# EAGLE design autoimpedance (EAGLE 6.5.0)

## Sheet 1 of 2: Power/charge
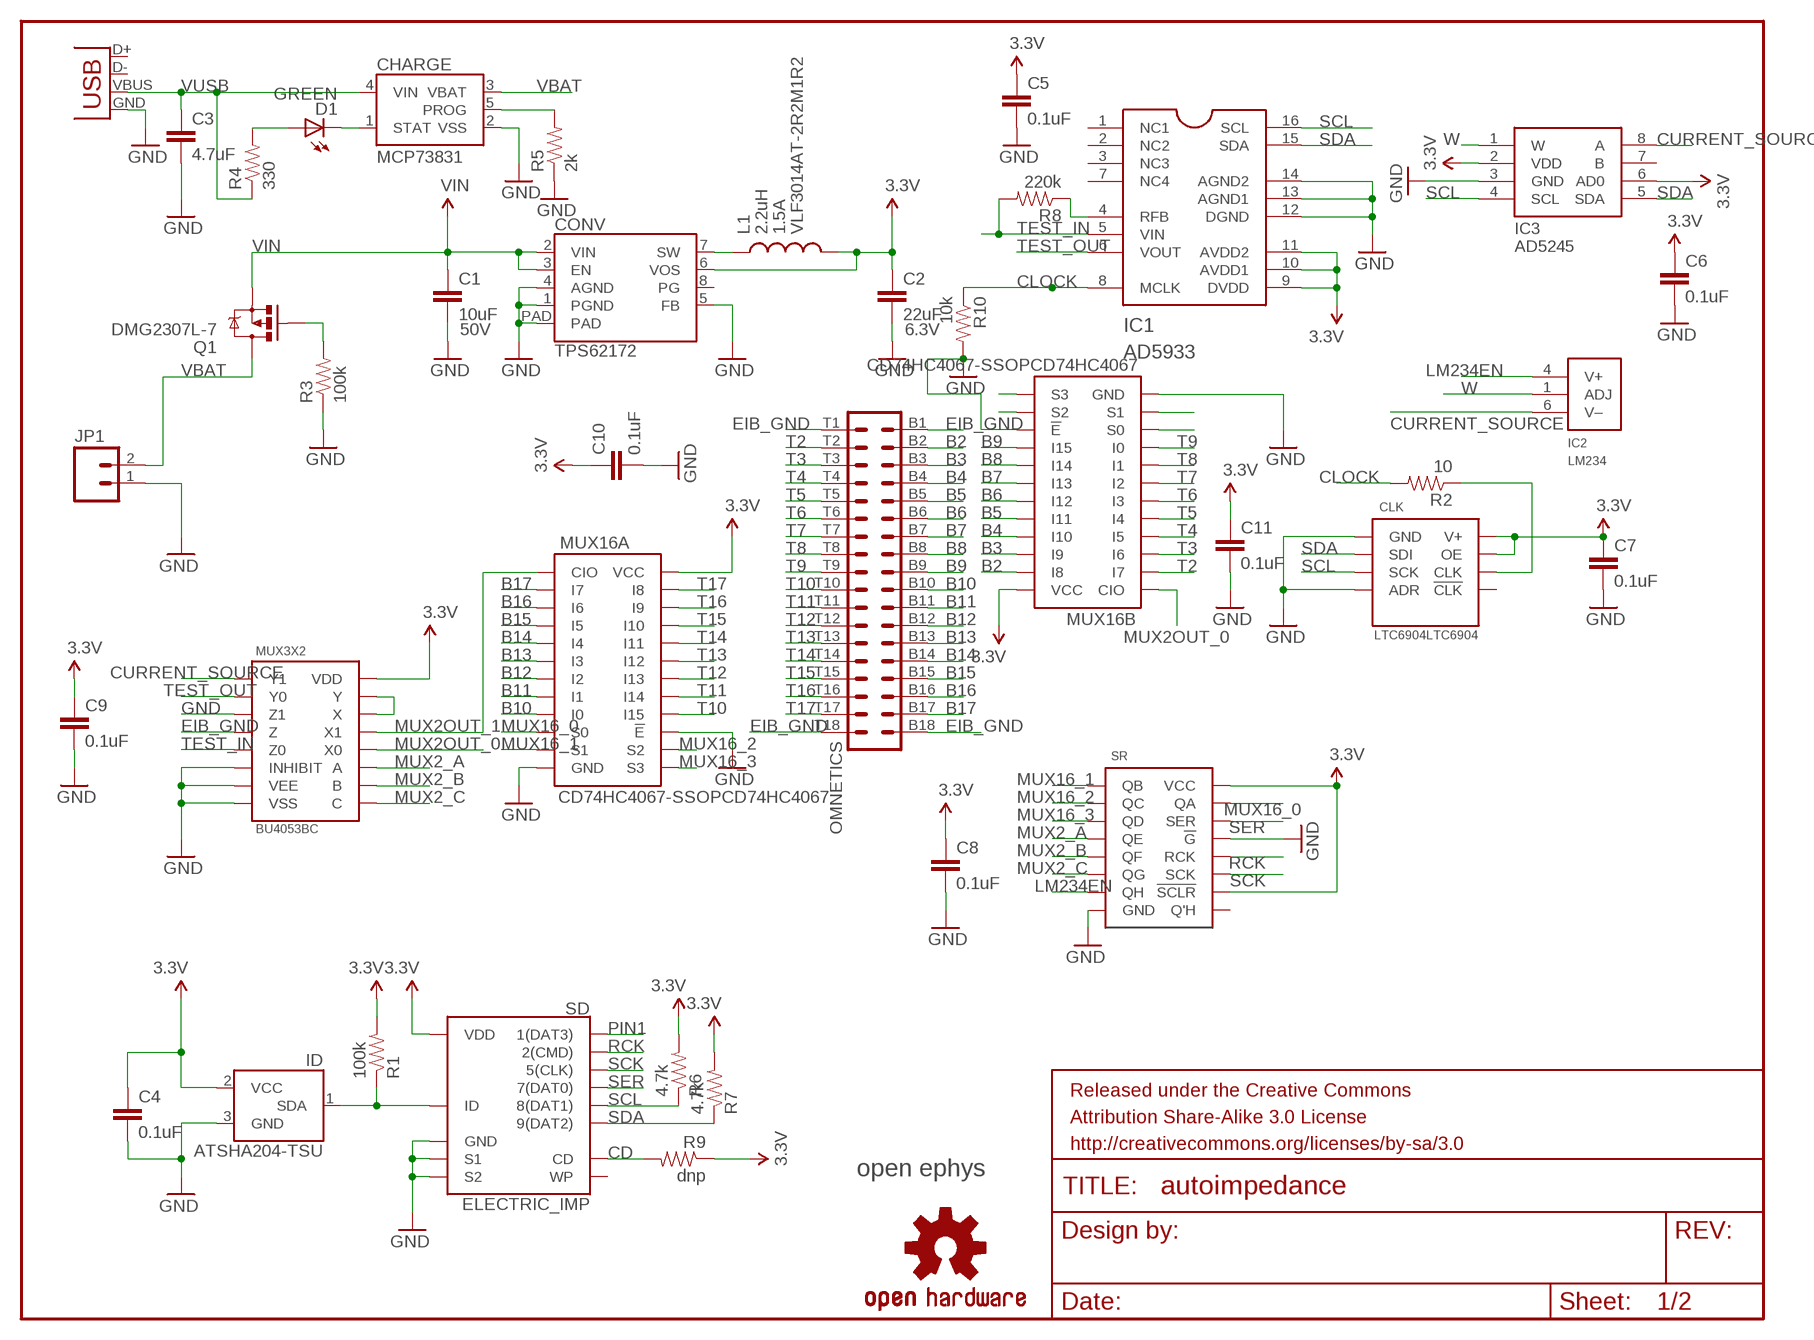
[diagram p0: schematic, sheet 1]

### Parts
C1  10uF  CAP1210  [1210]
C2  22uF  CAP0805  [0805]
C3  4.7uF  CAP1210  [1210]
C4  0.1uF  CAP0603-CAP  [0603-CAP]
C5  0.1uF  CAP0603-CAP  [0603-CAP]
C6  0.1uF  CAP0603-CAP  [0603-CAP]
C7  0.1uF  CAP0603-CAP  [0603-CAP]
C8  0.1uF  CAP0603-CAP  [0603-CAP]
C9  0.1uF  CAP0603-CAP  [0603-CAP]
C10  0.1uF  CAP0603-CAP  [0603-CAP]
C11  0.1uF  CAP0603-CAP  [0603-CAP]
CHARGE  MCP73831  [SOT23-5]
CLK  LTC6904LTC6904  [MSOP08]
CONV  TPS62172  [WSON-8-PAD]
D1  GREEN  LED-GREEN0603  [LED-0603]
FRAME1  FRAME-LETTER  [CREATIVE_COMMONS]
IC1  AD5933  [AD5933]
IC2  LM234  [LM234]
IC3  AD5245  [AD5245]
ID  ATSHA204-TSU  [SOT23-3]
JP1  M02SMD  [1X02_SMD]
L1  2.2uH  INDUCTORVLF4012A  [VLF4012A]
MUX3X2  BU4053BC  [SSOP16]
MUX16A  CD74HC4067-SSOPCD74HC4067  [SSOP24]
MUX16B  CD74HC4067-SSOPCD74HC4067  [SSOP24]
OMNETICS  OMNETICS_A79025  [OMNETICS_A79025]
Q1  DMG2307L-7  MOSFET-PCHANNELSMD  [SOT23-3]
R1  100k  RESISTOR0402-RES  [0402-RES]
R2  10  RESISTOR0402-RES  [0402-RES]
R3  100k  RESISTOR0402-RES  [0402-RES]
R4  330  RESISTOR0402-RES  [0402-RES]
R5  2k  RESISTOR0402-RES  [0402-RES]
R6  4.7k  RESISTOR0402-RES  [0402-RES]
R7  4.7k  RESISTOR0402-RES  [0402-RES]
R8  220k  RESISTOR0402-RES  [0402-RES]
R9  dnp  RESISTOR0402-RES  [0402-RES]
R10  10k  RESISTOR0402-RES  [0402-RES]
SD  ELECTRIC_IMP  [SD_MMC_SOCKET]
SR  MM74HC595MM74HC595  [TSSOP16]
U$5  OSHW-LOGOS  [OSHW-LOGO-S]
U$7  OPEN_EPHYS_LOGO  [OPEN_EPHYS_LOGO]
USB  USBSMD  [USB-MINIB]

### Nets
3.3V: C2.1 C4.1 C5.1 C6.1 C7.1 C8.1 C9.1 C10.1 C11.1 CLK.7(OE) CLK.8(V+) CONV.6(VOS) IC1.9(DVDD) IC1.10(AVDD1) IC1.11(AVDD2) IC3.2(VDD) IC3.6(AD0) ID.2(VCC) L1.P$2 MUX3X2.16(VDD) MUX16A.24(VCC) MUX16B.24(VCC) R1.2 R6.2 R7.2 R9.1 SD.4(VDD) SR.10(!SCLR) SR.16(VCC)
B2: MUX16B.23(I8) OMNETICS.B2
B3: MUX16B.22(I9) OMNETICS.B3
B4: MUX16B.21(I10) OMNETICS.B4
B5: MUX16B.20(I11) OMNETICS.B5
B6: MUX16B.19(I12) OMNETICS.B6
B7: MUX16B.18(I13) OMNETICS.B7
B8: MUX16B.17(I14) OMNETICS.B8
B9: MUX16B.16(I15) OMNETICS.B9
B10: MUX16A.9(I0) OMNETICS.B10
B11: MUX16A.8(I1) OMNETICS.B11
B12: MUX16A.7(I2) OMNETICS.B12
B13: MUX16A.6(I3) OMNETICS.B13
B14: MUX16A.5(I4) OMNETICS.B14
B15: MUX16A.4(I5) OMNETICS.B15
B16: MUX16A.3(I6) OMNETICS.B16
B17: MUX16A.2(I7) OMNETICS.B17
CD: R9.2 SD.CD
CLOCK: IC1.8(MCLK) R2.2 R10.1
CURRENT_SOURCE: IC2.6(V–) IC3.8(A) MUX3X2.1(Y1)
EIB_GND: MUX3X2.4(Z) OMNETICS.B1 OMNETICS.B18 OMNETICS.T1 OMNETICS.T18
GND: C1.2 C2.2 C3.2 C4.2 C5.2 C6.2 C7.2 C8.2 C9.2 C10.2 C11.2 CHARGE.2(VSS) CLK.1(GND) CLK.4(ADR) CONV.1(PGND) CONV.4(AGND) CONV.5(FB) CONV.PAD IC1.12(DGND) IC1.13(AGND1) IC1.14(AGND2) IC3.3(GND) ID.3(GND) JP1.1 MUX3X2.3(Z1) MUX3X2.6(INHIBIT) MUX3X2.7(VEE) MUX3X2.8(VSS) MUX16A.12(GND) MUX16A.15(!E) MUX16B.12(GND) MUX16B.15(!E) R3.1 R5.1 R10.2 SD.3(GND) SD.S1 SD.S2 SR.8(GND) SR.13(!G) USB.GND
ID: ID.1(SDA) R1.1 SD.6(ID)
LM234EN: IC2.4(V+) SR.7(QH)
MUX2_A: MUX3X2.11(A) SR.4(QE)
MUX2_B: MUX3X2.10(B) SR.5(QF)
MUX2_C: MUX3X2.9(C) SR.6(QG)
MUX2OUT_0: MUX3X2.12(X0) MUX16B.1(CIO)
MUX2OUT_1: MUX3X2.13(X1) MUX16A.1(CIO)
MUX16_0: MUX16A.10(S0) MUX16B.10(S0) SR.15(QA)
MUX16_1: MUX16A.11(S1) MUX16B.11(S1) SR.1(QB)
MUX16_2: MUX16A.14(S2) MUX16B.14(S2) SR.2(QC)
MUX16_3: MUX16A.13(S3) MUX16B.13(S3) SR.3(QD)
N$1: CONV.7(SW) L1.P$1
N$2: Q1.1(G) R3.2
N$3: IC1.4(RFB) R8.1
N$6: CHARGE.5(PROG) R5.2
N$8: D1.A R4.2
N$9: CHARGE.1(STAT) D1.C
N$25: CLK.6(CLK) R2.1
N$39: MUX3X2.14(X) MUX3X2.15(Y)
PIN1: SD.1(1(DAT3))
RCK: SD.2(2(CMD)) SR.12(RCK)
SCK: SD.5(5(CLK)) SR.11(SCK)
SCL: CLK.3(SCK) IC1.16(SCL) IC3.4(SCL) R6.1 SD.8(8(DAT1))
SDA: CLK.2(SDI) IC1.15(SDA) IC3.5(SDA) R7.1 SD.9(9(DAT2))
SER: SD.7(7(DAT0)) SR.14(SER)
T2: MUX16B.2(I7) OMNETICS.T2
T3: MUX16B.3(I6) OMNETICS.T3
T4: MUX16B.4(I5) OMNETICS.T4
T5: MUX16B.5(I4) OMNETICS.T5
T6: MUX16B.6(I3) OMNETICS.T6
T7: MUX16B.7(I2) OMNETICS.T7
T8: MUX16B.8(I1) OMNETICS.T8
T9: MUX16B.9(I0) OMNETICS.T9
T10: MUX16A.16(I15) OMNETICS.T10
T11: MUX16A.17(I14) OMNETICS.T11
T12: MUX16A.18(I13) OMNETICS.T12
T13: MUX16A.19(I12) OMNETICS.T13
T14: MUX16A.20(I11) OMNETICS.T14
T15: MUX16A.21(I10) OMNETICS.T15
T16: MUX16A.22(I9) OMNETICS.T16
T17: MUX16A.23(I8) OMNETICS.T17
TEST_IN: IC1.5(VIN) MUX3X2.5(Z0) R8.2
TEST_OUT: IC1.6(VOUT) MUX3X2.2(Y0)
VBAT: CHARGE.3(VBAT) JP1.2 Q1.3(D)
VIN: C1.1 CONV.2(VIN) CONV.3(EN) Q1.2(S)
VUSB: C3.1 CHARGE.4(VIN) R4.1 USB.VBUS
W: IC2.1(ADJ) IC3.1(W)
Unconnected: CLK.5(!CLK) CONV.8(PG) IC1.1(NC1) IC1.2(NC2) IC1.3(NC3) IC1.7(NC4) IC3.7(B) SD.WP SR.9(Q'H) USB.D+ USB.D-

### Notes on the sheet
- 1.5A | VLF3014AT-2R2M1R2
- 50V | 6.3V

## Sheet 2 of 2

## Library data of the parts
C1-C3 = SparkFun-Passives:CAP: Capacitor Standard 0603 ceramic capacitor, and 0.1" leaded capacitor.
C4-C11 = SparkFun-Capacitors:CAP: Capacitor Standard 0603 ceramic capacitor, and 0.1" leaded capacitor.
CHARGE = SparkFun-PowerIC:MCP73831: Miniature single cell, fully integrated Li-Ion, Li-polymer charge management controller http://ww1.microchip.com/downloads/en/DeviceDoc/21984a.pdf IC-09995; PROD_ID: IC-09995
CLK = open-ephys:LTC6904: I2C Clock LTC6904
CONV = SparkFun-PowerIC:TPS62172
D1 = SparkFun-LED:LED-GREEN: Various green LEDs 0603- DIO-00821 LARGE- DIO-00862 LILYPAD- DIO-09910; PROD_ID: DIO-00821
FRAME1 = SparkFun-Aesthetics:FRAME-LETTER: Schematic Frame Standard 8.5x11 US Letter frame
IC1 = autoimpedance:AD5933: I2C impedance tester
IC2 = josh:LM234
IC3 = autoimpedance:AD5245: I2C potentiometer (100KOhm)
ID = SparkFun-DigitalIC:ATSHA204
JP1 = SparkFun-Connectors:M02: Header 2 Standard 2-pin 0.1" header. Use with straight break away headers (SKU : PRT-00116), right angle break away headers (PRT-00553), swiss pins (PRT-00743), machine pins (PRT-00117), and female headers (PRT-00115). Molex polarized connector foot print use with SKU : PRT-08233 with associated crimp pins and housings.
L1 = SparkFun-Passives:INDUCTOR: Inductors Basic Inductor/Choke - 0603 and 1206. Footprints are not proven and vary greatly between part numbers. SRN6045- 33uH, 20% 1.4A
MUX3X2 = open-ephys:BU4053BC
MUX16A MUX16B = open-ephys:CD74HC4067-SSOP: High-speed CMOS Logic 16:1 Analog MUX
OMNETICS = RHD2000:OMNETICS_A79025
Q1 = SparkFun-DiscreteSemi:MOSFET-PCHANNEL: Generic PMOSFET
R1-R10 = SparkFun-Passives:RESISTOR: Resistor Basic schematic elements and footprints for 0603, 1206, and PTH resistors.
SD = SparkFun-RF:ELECTRIC_IMP
SR = open-ephys:MM74HC595: The MM74HC595 high-speed shift register possesses the high noise immunity and low power consumption of standard CMOS ICs, as well as the ability to drive 15 LS-TTL loads.
U$5 = SparkFun-Aesthetics:OSHW-LOGO: Open Source Hardware Logo This logo indicates the piece of hardware it is found on incorporates a OSHW license and/or adheres to the definition of open source hardware found here: http://freedomdefined.org/OSHW
U$7 = open-ephys:OPEN_EPHYS_LOGO: Open Ephys logo
USB = SparkFun-Connectors:USB: USB Connectors USB-B-PTH is fully proven SKU : PRT-00139 USB-miniB is fully proven SKU : PRT-00587 USB-A-PCB is untested. USB-A-H is throughly reviewed, but untested. Spark Fun Electronics SKU : PRT-00437 USB-B-SMT is throughly reviewed, but untested. Needs silkscreen touching up. USB-A-S has not been used/tested USB-MB-H has not been used/tested

## Board
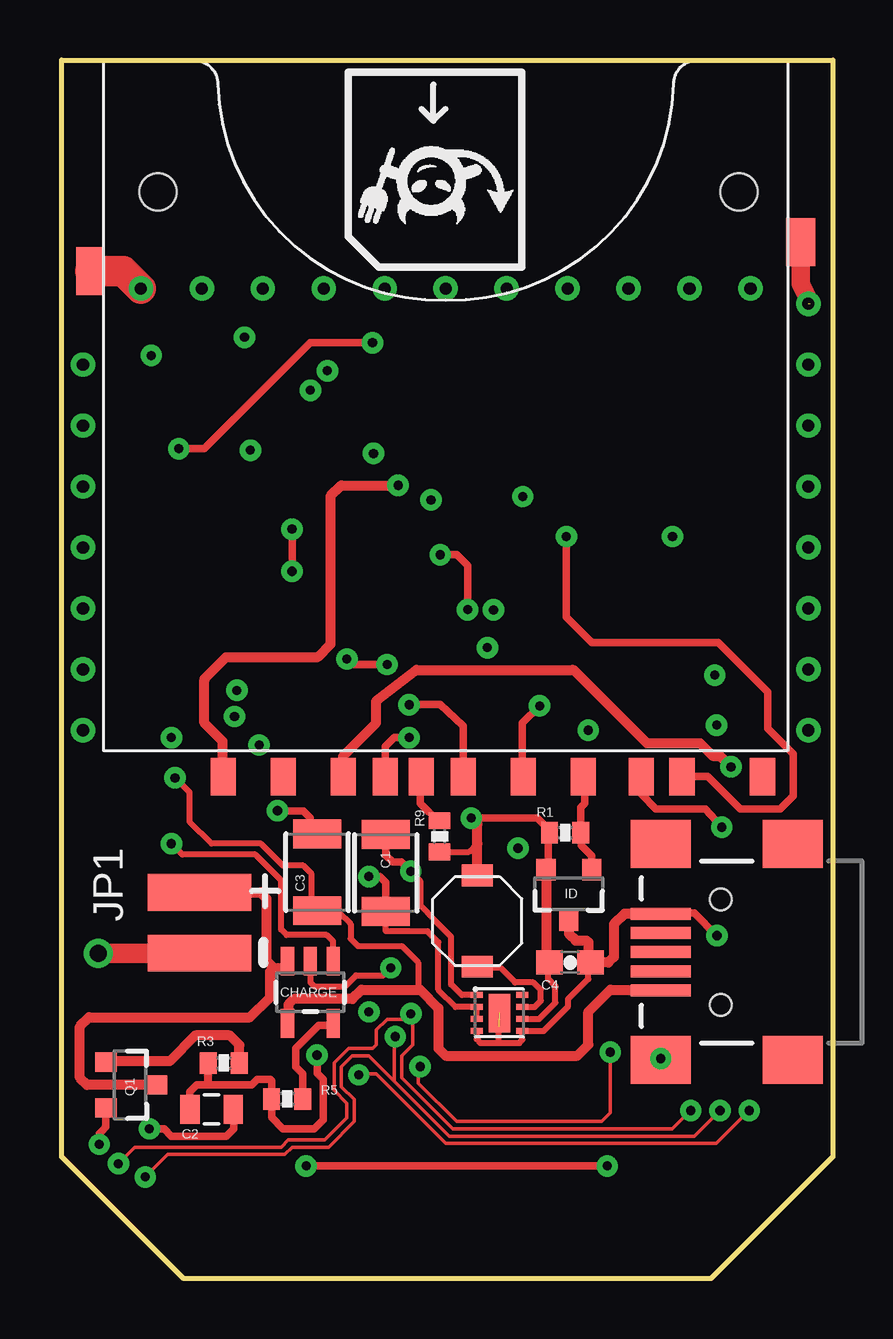
[diagram p1: board, top side]
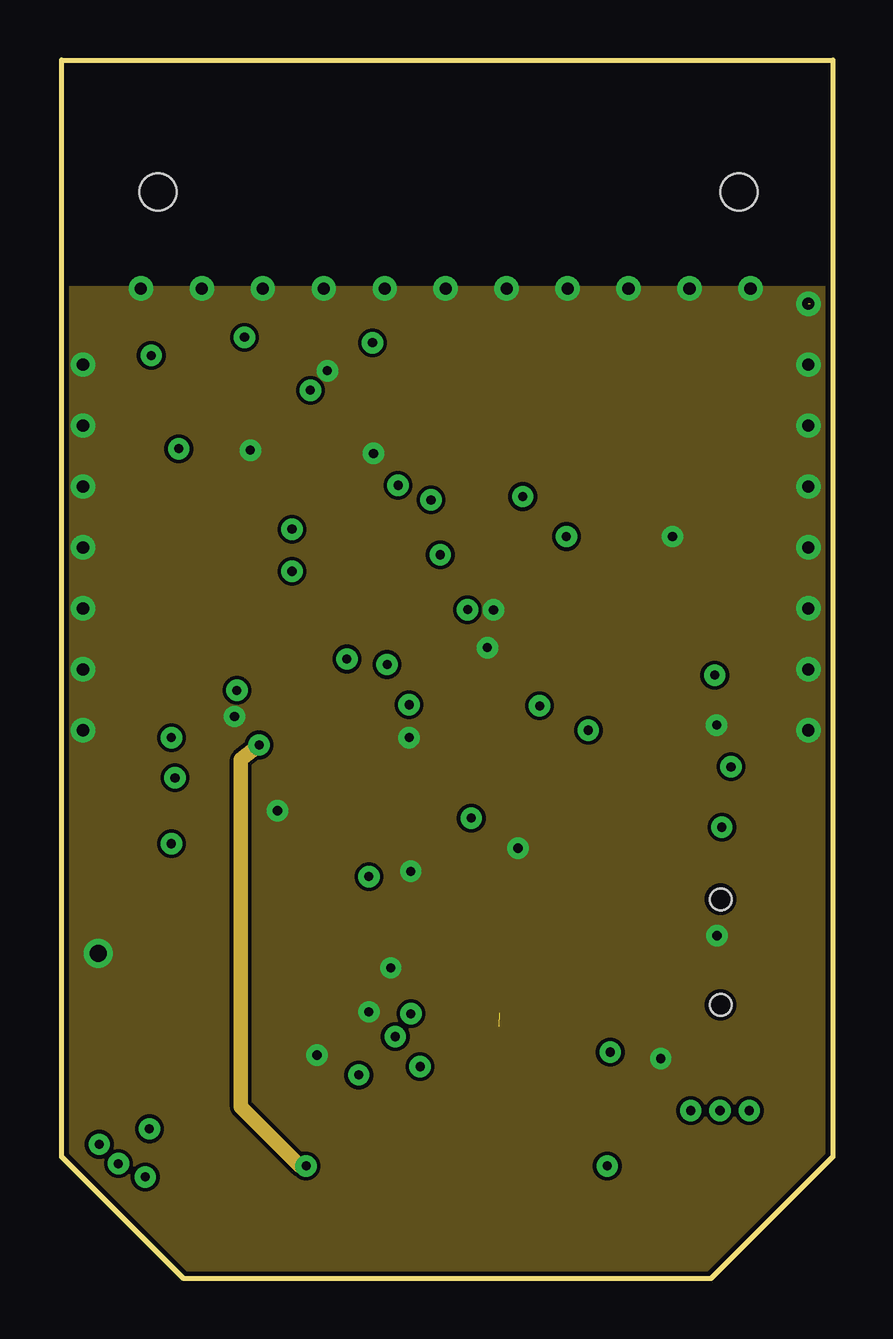
[diagram p2: board, inner layer Route2]
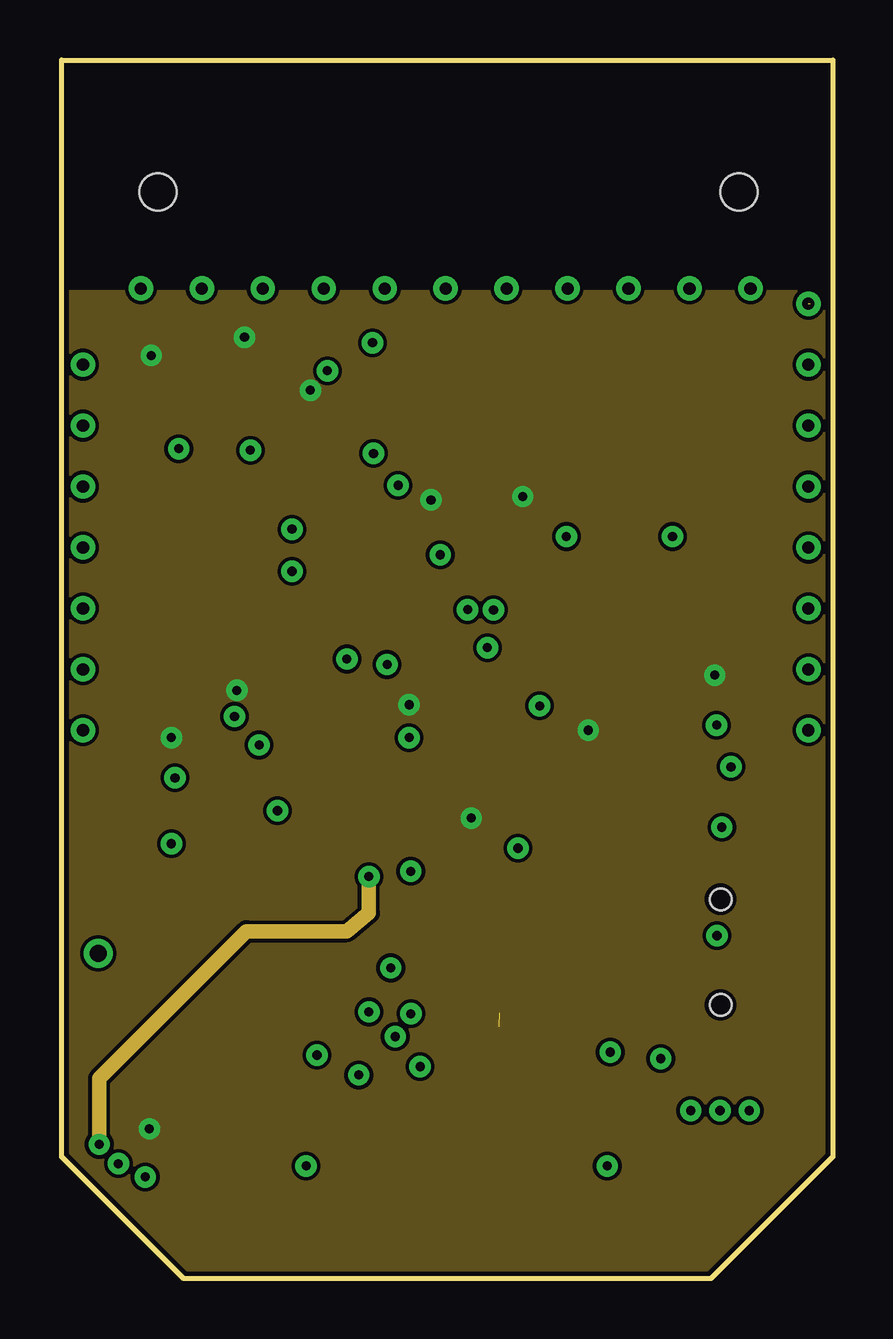
[diagram p3: board, inner layer Route3]
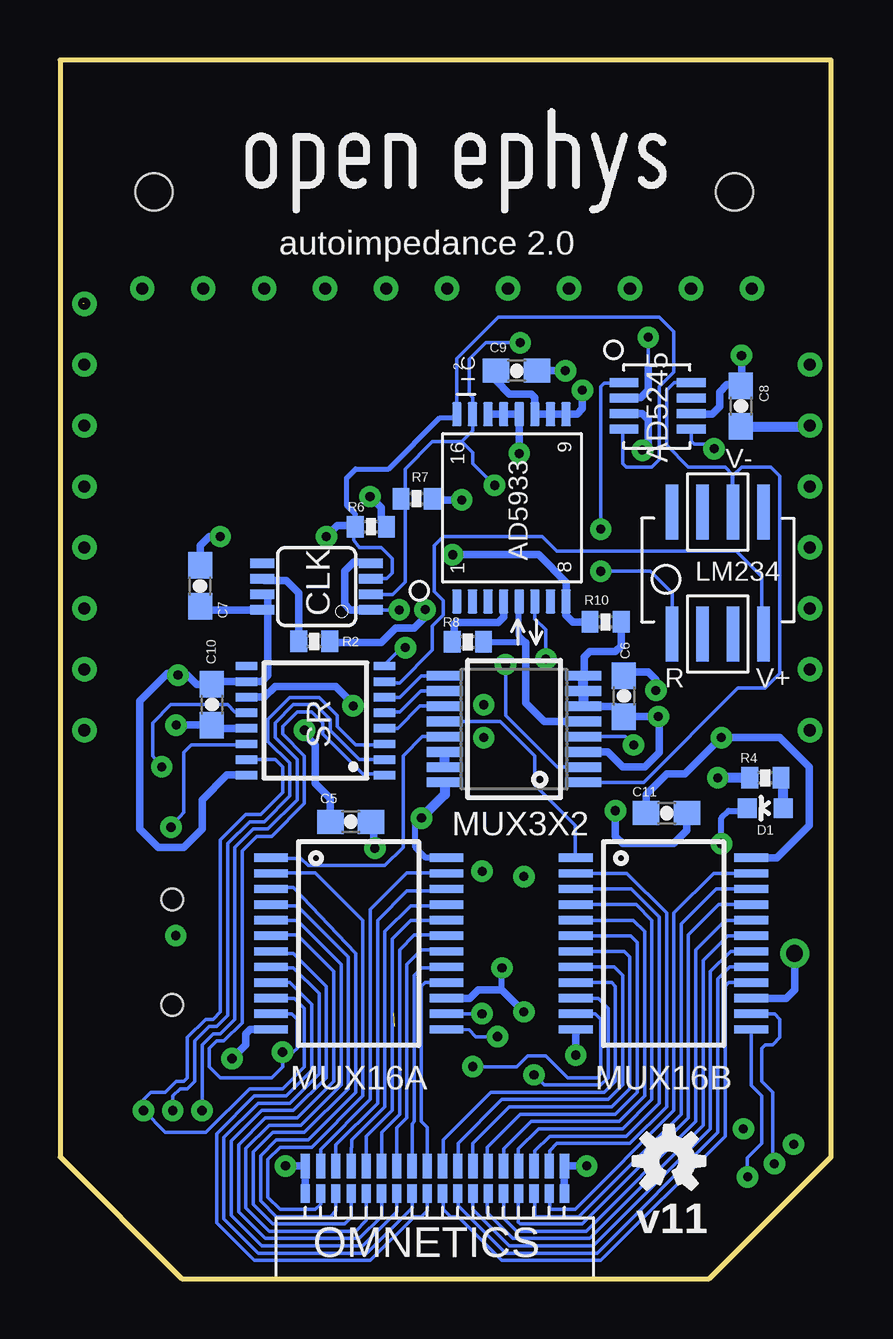
[diagram p4: board, bottom side, seen from below]

Size 32.13 x 50.8 mm. Coordinates in mm from the lower left corner, seen from the top.
Outline: 27.05,0 5.08,0 0,5.08 0,50.8 32.13,50.8 32.13,5.08 27.05,0
Copper layers (1*2*3*16): Top 0.035mm / dielectric 1.5mm / Route2 0.035mm / dielectric 0.15mm / Route3 0.035mm / dielectric 0.2mm / Bottom 0.035mm
Design rules "default *": minimum track width 6mil, minimum drill 15mil, track to track 6mil, track to pad 6mil, pad to pad 6mil, via to via 6mil, smd to smd 6mil, copper to edge 8mil, drill to drill 8mil, minimum pad ring 12mil, minimum via ring 10mil, stop-mask expansion 4mil, vias tented up to drill 20mil, thermal gap 10mil

### Footprints (pad centres in the part's own frame; a part is rotated, then mirrored left to right if it is on the bottom)
1210 = smd 1.2 x 2: 1 -1.6,0; 2 1.6,0
0805 = smd 0.8 x 1.2: 1 -0.9,0; 2 0.9,0
0603-CAP = smd 1.1 x 1: 1 -0.85,0; 2 0.85,0
SOT23-5 = smd 0.55 x 1.2: 1 -0.95,-1.3; 2 0,-1.3; 3 0.95,-1.3; 4 0.95,1.3; 5 -0.95,1.3
MSOP08 = smd 0.4 x 1: 1 -0.976,-2.263; 2 -0.326,-2.263; 3 0.324,-2.263; 4 0.974,-2.263; 5 0.974,2.262; 6 0.324,2.262; 7 -0.326,2.262; 8 -0.976,2.262
WSON-8-PAD = smd 0.25 x 0.5: 1 -0.75,-0.95; 2 -0.25,-0.95; 3 0.25,-0.95; 4 0.75,-0.95; 5 0.75,0.95; 6 0.25,0.95; 7 -0.25,0.95; 8 -0.75,0.95 | smd 1.6 x 0.9: PAD 0,0
LED-0603 = smd 0.8 x 0.8: A 0,-0.75; C 0,0.75
AD5933 = smd 1 x 0.4: 1 -4.128,2.54; 2 -4.128,1.89; 3 -4.128,1.24; 4 -4.128,0.59; 5 -4.128,-0.06; 6 -4.128,-0.71; 7 -4.128,-1.36; 8 -4.128,-2.01; 9 3.672,-2.01; 10 3.672,-1.36; 11 3.672,-0.71; 12 3.672,-0.06; 13 3.672,0.59; 14 3.672,1.24; 15 3.672,1.89; 16 3.672,2.54
LM234 = smd 0.508 x 2.286: 1 -1.905,-2.54; 2 -0.635,-2.54; 3 0.635,-2.54; 4 1.905,-2.54; 5 1.905,2.54; 6 0.635,2.54; 7 -0.635,2.54; 8 -1.905,2.54
AD5245 = smd 1.2 x 0.38: 1 -1.37,0.935; 2 -1.37,0.285; 3 -1.37,-0.365; 4 -1.37,-1.015; 5 1.43,-1.015; 6 1.43,-0.365; 7 1.43,0.285; 8 1.43,0.935
SOT23-3 = smd 0.8 x 0.9: 1 -0.95,-1; 2 0.95,-1; 3 0,1.1
1X02_SMD = smd 4.318 x 1.524: 1 0,1.27; 2 0,-1.27
VLF4012A = smd 0.9 x 1.3: P$1 -1.9,0; P$2 1.9,0
SSOP16 = smd 0.4 x 1.5: 1 -2.223,-2.883; 2 -1.587,-2.883; 3 -0.953,-2.883; 4 -0.318,-2.883; 5 0.318,-2.883; 6 0.953,-2.883; 7 1.587,-2.883; 8 2.223,-2.883; 9 2.223,2.883; 10 1.587,2.883; 11 0.953,2.883; 12 0.318,2.883; 13 -0.318,2.883; 14 -0.953,2.883; 15 -1.587,2.883; 16 -2.223,2.883
SSOP24 = smd 0.348 x 1.397: 1 -3.575,-3.656; 2 -2.925,-3.656; 3 -2.275,-3.656; 4 -1.625,-3.656; 5 -0.975,-3.656; 6 -0.325,-3.656; 7 0.325,-3.656; 8 0.975,-3.656; 9 1.625,-3.656; 10 2.275,-3.656; 11 2.925,-3.656; 12 3.575,-3.656; 13 3.575,3.656; 14 2.925,3.656; 15 2.275,3.656; 16 1.625,3.656; 17 0.975,3.656; 18 0.325,3.656; 19 -0.325,3.656; 20 -0.975,3.656; 21 -1.625,3.656; 22 -2.275,3.656; 23 -2.925,3.656; 24 -3.575,3.656
OMNETICS_A79025 = smd 0.381 x 0.762: B1 -5.397,-1.016; B2 -4.763,-1.016; B3 -4.128,-1.016; B4 -3.493,-1.016; B5 -2.857,-1.016; B6 -2.223,-1.016; B7 -1.587,-1.016; B8 -0.953,-1.016; B9 -0.318,-1.016; B10 0.318,-1.016; B11 0.953,-1.016; B12 1.587,-1.016; B13 2.223,-1.016; B14 2.857,-1.016; B15 3.493,-1.016; B16 4.128,-1.016; B17 4.763,-1.016; B18 5.397,-1.016 | smd 0.381 x 1.016: T1 -5.397,-2.159; T2 -4.763,-2.159; T3 -4.128,-2.159; T4 -3.493,-2.159; T5 -2.857,-2.159; T6 -2.223,-2.159; T7 -1.587,-2.159; T8 -0.953,-2.159; T9 -0.318,-2.159; T10 0.318,-2.159; T11 0.953,-2.159; T12 1.587,-2.159; T13 2.223,-2.159; T14 2.857,-2.159; T15 3.493,-2.159; T16 4.128,-2.159; T17 4.763,-2.159; T18 5.397,-2.159
0402-RES = smd 0.7 x 0.9: 1 -0.65,0; 2 0.65,0
SD_MMC_SOCKET = smd 1.05 x 1.56: 1 6.77,29.87; 2 4.27,29.87; 3 2.52,29.87; 4 -0.73,29.87; 5 -3.23,29.87; 6 -5.73,29.87; 7 -8.15,29.87; 8 -9.85,29.87; 9 9.27,29.87; CD 1.02,29.87; WP -13.2,29.87 | smd 1.2 x 2: S1 -14.8,7.6; S2 14.8,8.8 | hole 1.55: 11.98,5.5; -12.22,5.5
TSSOP16 = smd 0.9 x 0.35: 1 -2.875,2.275; 2 -2.875,1.625; 3 -2.875,0.975; 4 -2.875,0.325; 5 -2.875,-0.325; 6 -2.875,-0.975; 7 -2.875,-1.625; 8 -2.875,-2.275; 9 2.875,-2.275; 10 2.875,-1.625; 11 2.875,-0.975; 12 2.875,-0.325; 13 2.875,0.325; 14 2.875,0.975; 15 2.875,1.625; 16 2.875,2.275
USB-MINIB = smd 2.5 x 0.5: D+ 2.5,0; D- 2.5,0.8; GND 2.5,-1.6; ID 2.5,-0.8; VBUS 2.5,1.6 | smd 2.5 x 2: MTN1 -3,4.5; MTN2 2.5,4.5; MTN3 -3,-4.5; MTN4 2.5,-4.5 | hole 0.9: 0,2.2; 0,-2.2

### Placement (x,y rotation side)
C1  13.51,16.92 90 top
C2  6.25,7.06 180 top
C3  10.64,16.94 90 top
C4  21.18,13.18 0 top
C5  20.02,19.05 0 bottom
C6  8.64,24.28 270 bottom
C7  26.29,28.88 90 bottom
C8  3.76,36.37 270 bottom
C9  13.11,37.85 0 bottom
C10  25.81,23.93 270 bottom
C11  6.86,19.41 0 bottom
CHARGE  10.36,11.94 180 top
CLK  21.44,28.85 90 bottom
CONV  18.24,11.07 270 top
D1  2.74,19.61 90 bottom
FRAME1  -3.73,-11.73 0 top  (outside the outline)
IC1  13.06,32.36 90 bottom
IC2  4.72,29.41 0 bottom
IC3  7.26,36.42 0 bottom
ID  21.13,16.05 180 top
JP1  5.74,14.83 180 top
L1  17.32,14.91 90 top
MUX3X2  13.21,22.91 90 bottom
MUX16A  19.68,13.97 270 bottom
MUX16B  6.99,13.97 270 bottom
OMNETICS  16.51,2.54 180 bottom
Q1  2.84,8.08 270 top
R1  20.98,18.59 180 top
R2  21.54,26.57 0 bottom
R3  6.76,8.99 0 top
R4  2.74,20.88 0 bottom
R5  9.4,7.49 0 top
R6  19.18,31.34 0 bottom
R7  17.27,32.51 0 bottom
R8  15.14,26.54 0 bottom
R9  15.75,18.44 90 top
R10  9.4,27.38 0 bottom
SD  16,50.8 180 top
SR  21.49,23.27 180 bottom
U$5  6.76,4.9 0 bottom
U$7  25.04,43.94 0 bottom
USB  27.46,13.61 180 top

### Tracks (layer width: path | path; a pad name or v marks a point on that pad's centre or on a via)
3.3V  (via drill 0.38)
  Top 0.152: 20.27,18.23 R1.2 | 7.16,6.97 C2.1
  Top 0.254: CONV.6 19.89,10.82 20.57,11.51 20.57,12.19 20.27,12.5 20.27,13.19 C4.1 | R9.1 16.98,17.79 17.32,18.14
  Top 0.305: ID.2 20.26,17.06 20.27,17.6 20.27,18.23 | SD.4 16.73,23.04 15.77,23.93 v14.48,23.93 | v3.66,6.25 4.27,6.25 4.57,5.94 6.86,5.94 7.16,6.25 7.16,6.97 | C2.1 7.14,6.99 7.09,7.01 | R1.2 20.33,18.68 19.81,19.2 v17.07,19.2
  Top 0.406: ID.2 20.18,13.41 C4.1 | L1.P$2 17.32,18.14 17.32,18.95 v17.07,19.2 | 16.76,20.9 SD.4
  Bottom 0.152: 25.69,24.89 C10.1 | 5.74,35.97 IC3.6 | IC3.2 8.1,36.71 | 8.84,36.73 8.53,36.73 | 7.62,38.02 v7.62,39.24 | IC3.6 5.88,36.06 6.02,36.04 5.79,36.12 | 23.47,27.95 CLK.8 | C9.1 13.96,37.43 | IC1.11 | R6.2 18.75,31.55 | R7.2 16.51,32.51 16.46,32.46 | 27.23,25.22 v27.21,25.16 | C8.1 3.77,37.53 3.77,37.38 | 5.77,36.12 IC3.6 | 26.21,27.88 C7.1
  Bottom 0.254: MUX16A.24 16.89,17.55 17.32,17.98 17.32,18.95 v17.07,19.2 | 8.47,25.3 C6.1 8.84,24.93
  Bottom 0.305: SR.16 25.19,20.99 26.21,19.96 26.21,18.75 26.98,17.98 28.04,17.98 28.8,18.75 28.8,24.08 27.66,25.22 27.23,25.22 | 25.69,24.89 SR.10 23.72,24.89 23.47,25.15 23.47,27.95 23.47,28.56 CLK.7 | 8.1,36.71 8.84,36.73 | 8.53,36.73 7.92,36.73 7.62,37.03 7.62,38.02 | C11.1 7.71,20.18 6.86,21.03 6.1,21.03 v4.57,22.55 2.13,22.55 0.91,21.34 0.91,18.9 2.27,17.55 MUX16B.24 | C10.1 26.44,24.77 26.83,25.16 v27.21,25.16 | IC1.11 IC1.10 IC1.9 10.58,36.03 10.36,36.27 v10.36,37.03 | 13.96,37.43 13.41,36.88 12.5,36.88 12.34,36.73 IC1.11 | 18.75,31.55 18.75,32.14 v19.21,32.6 | 16.46,32.46 v15.39,32.46 | CLK.8 26.21,27.88 | C5.1 20.86,20.03 21.49,20.65 21.49,22.25 21.95,22.71 v21.95,22.86 | v7.3,24.52 7.3,24.98 7.62,25.3 8.47,25.3 | 6.02,36.04 4.95,36.04 4.65,36.35 4.65,36.96 4.34,37.26 3.8,37.26 C8.1 | 3.77,37.53 3.73,37.57 v3.73,38.48
  Bottom 0.406: MUX3X2.16 16.09,20.18 v17.07,19.2
  pour Route3: 0.15,4.72 0.3,4.72 5.03,0 27.13,0 32,4.88 32.16,5.03 32.16,41.15 0.3,41.15 0.15,41
B2
  Bottom 0.152: MUX16B.23 4.9,16.89 6.55,15.24 6.55,7.01 10.67,2.9 11.73,2.9 11.73,3.54 OMNETICS.B2
B3
  Bottom 0.152: MUX16B.22 4.79,16.25 6.25,14.78 6.25,6.86 10.52,2.59 12.34,2.59 12.34,3.52 OMNETICS.B3
B4
  Bottom 0.152: MUX16B.21 4.67,15.6 5.94,14.33 5.94,6.71 10.36,2.29 12.95,2.29 13.03,2.36 13.03,3.39 OMNETICS.B4
B5
  Bottom 0.152: MUX16B.20 4.41,14.95 5.64,13.72 5.64,6.55 10.21,1.98 13.11,1.98 13.64,2.52 13.64,3.42 OMNETICS.B5
B6
  Bottom 0.152: MUX16B.19 4.3,14.29 5.33,13.26 5.33,6.4 10.06,1.68 13.26,1.68 14.33,2.74 14.33,3.52 OMNETICS.B6
B7
  Bottom 0.152: MUX16B.18 4.19,13.64 5.03,12.8 5.03,6.25 9.91,1.37 13.41,1.37 14.94,2.9 14.94,3.54 | 14.94,3.66 14.94,3.54 | 14.94,3.54 OMNETICS.B7
B8
  Bottom 0.152: MUX16B.17 4.23,12.99 4.72,12.5 4.72,6.1 9.75,1.07 13.56,1.07 15.54,3.05 15.54,3.54 OMNETICS.B8
B9
  Bottom 0.152: MUX16B.16 4.27,12.35 4.42,12.19 4.42,5.94 9.6,0.76 13.72,0.76 15.54,2.59 15.85,2.59 16.15,2.9 16.15,3.52 OMNETICS.B9
B10
  Bottom 0.152: OMNETICS.B10 16.83,2.83 17.07,2.59 17.37,2.59 19.2,0.76 24.03,0.76 25.6,2.34 25.6,6.04 24.03,7.62 22.71,7.62 21.64,8.69 21.64,11.43 22.55,12.34 MUX16A.9
B11
  Bottom 0.152: OMNETICS.B11 17.46,2.96 19.36,1.07 23.88,1.07 25.3,2.49 25.3,5.89 23.88,7.32 22.55,7.32 21.34,8.53 21.34,11.89 22.4,12.95 23.3,12.95 MUX16A.8
B12
  Bottom 0.152: OMNETICS.B12 18.1,2.78 19.51,1.37 23.72,1.37 24.99,2.64 24.99,5.74 23.72,7.01 22.4,7.01 21.03,8.38 21.03,12.19 22.4,13.56 23.26,13.56 MUX16A.7
B13
  Bottom 0.152: OMNETICS.B13 18.73,2.6 19.66,1.68 23.57,1.68 24.69,2.79 24.69,5.59 23.57,6.71 22.25,6.71 20.73,8.23 20.73,12.8 22.25,14.33 23.31,14.33 MUX16A.6
B14
  Bottom 0.152: OMNETICS.B14 19.37,2.43 19.81,1.98 23.42,1.98 24.38,2.95 24.38,5.44 23.42,6.4 22.1,6.4 20.42,8.08 20.42,13.11 22.25,14.94 23.33,14.94 MUX16A.5
B15
  Bottom 0.152: OMNETICS.B15 20,2.55 20.27,2.29 23.27,2.29 24.08,3.1 24.08,5.28 23.27,6.1 21.95,6.1 20.12,7.92 20.12,13.41 22.25,15.54 23.29,15.54 MUX16A.4
B16
  Bottom 0.152: OMNETICS.B16 20.64,2.83 20.88,2.59 23.11,2.59 23.77,3.25 23.77,5.13 23.11,5.79 21.79,5.79 19.81,7.77 19.81,13.56 22.4,16.31 23.28,16.31 MUX16A.3
B17
  Bottom 0.152: OMNETICS.B17 21.27,3.11 21.49,2.9 22.96,2.9 23.47,3.4 23.47,4.98 22.96,5.49 21.64,5.49 19.51,7.62 19.51,14.94 21.49,16.92 23.32,16.92 MUX16A.2
CD
  Top 0.152: 14.87,20.82 SD.CD
  Top 0.254: 14.94,20.88 SD.CD
  Top 0.305: R9.2 15.29,19.46 14.94,19.81 14.94,20.88
CLOCK  (via drill 0.38)
  Top 0.305: v15.77,30.18 16.46,30.18 16.92,29.72 v16.92,27.89
  Bottom 0.152: 20.84,26.52 R2.2
  Bottom 0.305: v15.77,30.18 12.19,30.18 11.05,29.03 IC1.8 11.05,27.66 10.77,27.38 R10.1 | v16.92,27.89 16.92,27.58 17.37,27.13 18.14,27.13 18.75,26.52 20.84,26.52
CURRENT_SOURCE
  Bottom 0.152: MUX3X2.1 7.81,20.69 3.89,24.61 2.74,24.61 2.13,25.22 2.13,33.45 2.52,33.83 3.73,33.83 4.09,33.48 IC2.6 4.04,32 4.04,32.54 4.12,32.61 4.12,33.53 4.42,33.83 5.94,33.83 6.86,34.75 6.86,37.03 6.53,37.36 IC3.8
EIB_GND  (via drill 0.38)
  Top 0.305: v10.19,4.7 v22.73,4.7
  Route2 0.152: v10.19,4.7 10.08,4.7
  Route2 0.61: 10.08,4.7 9.93,4.7 7.47,7.16 7.47,21.64 v8.23,22.25
  Bottom 0.152: MUX3X2.4 8.57,22.59 v8.23,22.25
  Bottom 0.305: OMNETICS.B1 OMNETICS.T1 v10.19,4.7 | OMNETICS.B18 OMNETICS.T18 v22.73,4.7
GND  (via drill 0.38, 0.51, 0.7)  (2 unrouted)
  Top 0.152: USB.GND 25.91,15.24
  Top 0.254: CONV.1 16.67,11.82 16.23,12.27 16.23,14.25 15.54,14.94 14.96,15.54 14.94,15.57 14.94,16.59 v14.54,16.98 | C4.2 21.95,13.17 21.95,12.5 21.11,11.66 21.11,11.35 20.08,10.32 CONV.5 19.2,10.31 19.2,9.96 19.07,9.83 18.21,9.83 18.21,9.91 | CHARGE.2 10.36,12.34 10.52,12.19 11.81,12.19 12.27,12.65 13.41,12.65 v13.72,12.95 | CONV.4 17.29,9.99 17.45,9.83 18.14,9.83 18.21,9.91 | 18.21,9.91 18.21,10.52
  Top 0.305: SD.3 13.48,22.18 13.87,22.55 v14.48,22.55 | 25.91,15.24 26.36,15.24 v27.3,14.3 | C2.2 5.35,7.79 5.64,8.08 6.1,8.08 | 6.1,8.08 6.1,8.83 R3.1 6.11,8.37 6.1,8.08 | 6.1,8.08 7.92,8.08 8.15,8.31 8.7,8.31 8.75,8.26 R5.1 8.75,6.72 9.22,6.25 10.52,6.25 10.9,6.63 10.9,8.31 10.64,8.56 v10.64,9.32 | C1.2 13.51,17.65 13.79,17.37 14.15,17.37 v14.54,16.98 | v8.99,19.51 10.06,19.51 10.36,19.2 10.36,18.52 C3.2
  Top 0.406: USB.GND 23.44,15.21 23.01,14.78 23.01,13.41 22.78,13.18 C4.2 21.95,13.35 21.95,14.02 21.87,14.1 21.41,14.1 21.13,14.38 ID.3
  Top 0.762: SD.S1 30.8,41.47 31.19,40.64
  Top 0.813: JP1.1 v1.52,13.56
  Top 1.27: SD.S2 2.58,42 v3.3,41.27
  Bottom 0.152: MUX16B.12 10.36,10.36 | SR.8 18.59,25.6 17.89,26.3 v17.74,26.3 | 25.67,22.94 C10.2 | v27.3,14.3 27.28,14.33 | CLK.1 v17.99,27.88 | v14.48,22.55 14.33,22.55 | C6.2 8.65,23.28 | 8.65,23.28 8.99,23.85 | 10.26,23.85 MUX3X2.6 | C5.2 19.05,19.2 | 19.05,17.98 v19.01,17.95 | 8.65,23.28 8.88,23.28 8.69,23.32 | 7.16,23.39 v7.2,23.43 | MUX3X2.8 10.32,25.18 | 8.99,27.14 R10.2 | 0.93,35.52 v0.89,35.56
  Bottom 0.254: 13.72,12.04 v13.72,12.95
  Bottom 0.305: MUX3X2.3 9.31,21.96 8.69,21.34 7.77,21.34 7.16,21.95 7.16,23.39 | SR.13 25.67,22.94 | C7.2 26.29,30.56 25.91,30.94 v25.45,30.94 | C9.2 v11.07,37.85 | 8.99,23.85 10.26,23.85 | C6.2 v7.2,23.43 | 19.05,19.2 19.05,17.98 | C10.2 v27.29,23.08 | MUX16B.15 1.87,11.7 1.52,12.04 v1.52,13.56 | C11.2 6.01,18.68 6.55,18.14 8.69,18.14 8.99,18.44 v8.99,19.51 | IC1.14 IC1.13 IC1.12 v13,34.4 | MUX16A.12 24.2,10.39 24.38,10.21 24.38,9.75 v24.96,9.18 | MUX16A.15 15.05,11.7 14.71,12.04 13.72,12.04 v12.8,11.12 | IC3.3 7.87,36.06 7.62,35.81 7.62,34.78 v7.87,34.53 | 10.32,25.18 10.29,25.22 10.29,25.91 10.06,26.14 8.99,26.14 8.75,26.38 R10.2 | CLK.1 20.03,27.88 20.27,28.12 20.27,29.49 19.89,29.87 19.22,29.87 CLK.4 | 10.36,10.36 10.51,10.36 10.64,10.24 v10.64,9.32
  Bottom 0.406: C8.2 0.93,35.52 | MUX3X2.8 MUX3X2.7 MUX3X2.6
  other vias: 31.11,40.64 31.11,38.1 31.11,35.56 31.11,33.02 31.11,30.48 31.11,27.94 31.11,25.4 31.11,22.86 0.89,22.86 0.89,25.4 0.89,27.94 0.89,30.48 0.89,33.02 0.89,38.1 5.84,41.27 8.38,41.27 10.92,41.27 13.46,41.27 16,41.27 18.54,41.27 21.08,41.27 23.62,41.27 26.16,41.27 28.7,41.27
  pour Route2: 0.3,5.18 5.33,0.15 5.33,0 26.67,0 32,5.33 32,41.3 0.15,41.3 0,41
ID
  Top 0.152: 21.64,18.28 R1.1 | 21.79,20.87 SD.6
  Top 0.305: ID.1 22.08,17.62 21.64,18.06 21.64,18.28 | R1.1 21.63,19.65 21.79,19.81 21.79,20.87
LM234EN
  Bottom 0.152: SR.7 18.56,24.84 17.98,24.84 16.61,26.21 16.61,27.2 16.15,27.66 16.15,28.27 16.54,28.65 16.54,30.56 16.15,30.94 12.04,30.94 11.43,30.33 3.96,30.33 2.9,29.26 2.9,26.95 IC2.4
MUX2_A
  Bottom 0.152: MUX3X2.11 17.13,23.86 18.06,22.94 18.53,22.94 SR.4
MUX2_B
  Bottom 0.152: MUX3X2.10 17.11,24.5 17.98,23.62 18.58,23.62 SR.5
MUX2_C
  Bottom 0.152: MUX3X2.9 17.08,25.13 17.98,24.23 SR.6
MUX2OUT_0
  Bottom 0.152: MUX3X2.12 13.78,23.23 12.34,21.79 12.34,20.57 10.67,18.9 10.67,17.57 MUX16B.1
MUX2OUT_1
  Bottom 0.152: MUX3X2.13 17.03,22.59 17.83,21.79 17.83,17.98 18.59,17.22 21.79,17.22 22.1,17.53 23.32,17.53 MUX16A.1
MUX16_0  (via drill 0.38)
  Top 0.152: v12.38,8.49 12.34,8.53 13.11,8.53 16,5.64 27.28,5.64 v28.65,7.01
  Bottom 0.152: SR.15 23.16,21.64 22.86,21.34 22.86,20.27 23.77,19.36 24.38,19.36 25.45,18.29 25.45,11.12 25.76,10.82 26.06,10.82 26.82,10.06 26.82,8.38 26.98,8.23 27.28,8.23 27.74,7.77 28.35,7.77 28.65,7.47 v28.65,7.01 27.74,6.1 26.06,6.1 24.23,7.92 22.86,7.92 21.95,8.84 21.95,11.28 22.36,11.7 MUX16A.10 | MUX16B.10 9.71,11.7 9.3,11.28 9.3,8.38 9.6,8.08 11.96,8.08 v12.38,8.49
MUX16_1  (via drill 0.38)
  Top 0.152: v22.86,9.45 22.86,6.91 22.5,6.55 16.46,6.55 14.86,8.15 14.86,8.61 v14.94,8.84
  Bottom 0.152: 23.41,10.97 MUX16A.11 22.48,11.04 22.25,10.82 22.25,9.6 22.4,9.45 v22.86,9.45 | 22.86,8.99 v22.86,9.45 | 11.05,11.04 MUX16B.11 9.83,11.04 9.6,10.82 9.6,8.53 9.75,8.38 10.97,8.38 11.89,9.3 12.65,9.3 13.11,8.84 v14.94,8.84 | v22.86,9.45 22.86,8.84 23.32,8.38 25.45,8.38 25.91,8.84 25.91,9.6 25.6,9.91 25.3,9.91 24.54,10.67 24.54,17.83 23.93,18.44 23.32,18.44 21.95,19.81 21.95,21.79 22.86,22.71 22.86,23.01 22.25,23.62 21.64,23.62 21.18,23.16 21.18,22.71 19.51,21.03 18.65,21.03 SR.1
MUX16_2  (via drill 0.38)
  Top 0.152: 26.06,7.06 v26.21,7.01 25.45,6.25 16.31,6.25 14.17,8.38 14.17,9.3 14.63,9.75 14.63,11.12 v14.55,11.04 14.33,10.82 13.56,10.82 13.11,10.36 13.11,9.75 12.95,9.6 11.96,9.6 11.35,8.99 11.35,7.85 11.89,7.32 11.89,6.71 10.97,5.79 9.45,5.79 9.14,5.49 3.06,5.49 v2.37,4.8
  Bottom 0.152: MUX16A.14 v14.55,11.04 | v26.21,7.01 26.21,9.75 25.76,10.21 25.45,10.21 24.84,10.82 24.84,17.98 24.08,18.75 23.47,18.75 22.25,19.96 22.25,21.64 23.16,22.55 23.16,23.16 22.4,23.93 21.49,23.93 20.88,23.32 20.88,22.86 19.66,21.64 SR.2 | MUX16B.14 2.36,11.04 2.13,10.82 2.13,10.06 2.44,9.75 2.74,9.75 2.9,9.6 2.9,8.23 2.44,7.77 2.44,4.87 v2.37,4.8
MUX16_3  (via drill 0.38)
  Top 0.152: 13.87,8.23 16.15,5.94 26.36,5.94 v27.43,7.01 | v13.9,10.09 13.87,9.6 13.87,8.23 | 13.87,8.23 12.8,9.3 12.12,9.3 11.66,8.84 11.66,8 12.19,7.47 12.19,6.55 11.12,5.49 9.6,5.49 9.3,5.18 4.42,5.18 v3.48,4.24
  Bottom 0.152: MUX16A.13 15.09,10.36 14.81,10.09 v13.9,10.09 | v27.43,7.01 27.43,7.62 27.13,7.92 26.82,7.92 26.52,8.23 26.52,9.91 25.91,10.52 25.6,10.52 25.15,10.97 25.15,18.14 24.23,19.05 23.62,19.05 22.55,20.12 22.55,21.49 23.47,22.4 23.47,23.32 22.55,24.23 21.34,24.23 20.57,23.47 20.57,23.01 19.81,22.25 18.65,22.25 SR.3 | MUX16B.13 3.33,8.05 2.9,7.62 2.9,5.64 3.5,5.03 3.5,4.27 v3.48,4.24
N$1
  Top 0.254: CONV.7 19.71,11.32 19.96,11.58 19.96,12.04 19.66,12.34 18.9,12.34 18.29,12.95 17.38,12.95 L1.P$1
N$2
  Top 0.305: 1.96,9.07 Q1.1
  Top 0.406: R3.2 7.41,9.74 7.01,10.13 5.56,10.13 4.5,9.07 1.96,9.07
N$3
  Bottom 0.152: IC1.4 13.64,28.16 | 15.7,26.86 R8.1
  Bottom 0.305: 13.64,28.16 13.64,27.58 13.87,27.36 15.62,27.36 15.7,27.28 15.7,26.86
N$6
  Top 0.305: CHARGE.5 11.35,10.59 11.32,10.56 10.71,10.56 9.75,9.6 9.75,8.84 10.05,8.54 R5.2
N$8
  Bottom 0.152: 1.99,20.78 R4.2
  Bottom 0.406: D1.A 1.99,20.78
N$9  (via drill 0.38)
  Top 0.254: CHARGE.1 11.31,14.06 11.05,14.33 9.37,14.33 9.14,14.55 9.14,16.61 8.08,17.68 5.03,17.68 v4.57,18.14
  Bottom 0.254: v4.57,18.14 4.57,19.2 4.27,19.51 3.6,19.51 D1.C
N$25
  Bottom 0.152: 23.63,29.11 CLK.6
  Bottom 0.305: R2.1 22.19,28.59 22.71,29.11 23.63,29.11
N$39
  Bottom 0.406: MUX3X2.15 MUX3X2.14
RCK  (via drill 0.38)
  Top 0.406: SD.2 11.73,21.74 arc-45 11.77,21.83 13.11,23.16 13.11,24.03 arc-45 13.14,24.12 14.78,25.38 21.28,25.38 arc-45 21.37,25.34 24.38,22.33 26.54,22.33 arc-45 26.63,22.29 27.13,21.79 27.43,21.79 v27.89,21.34 27.85,21.38
  Bottom 0.152: v27.89,21.34 28.27,21.79 28.27,23.16 27.51,23.93 25.15,23.93 24.84,23.62 24.39,23.62 SR.12
SCK  (via drill 0.38)
  Top 0.152: SD.5 19.2,20.88
  Top 0.305: 19.2,20.88 19.2,23.16 v19.92,23.88
  Bottom 0.305: SR.11 23.61,24.24 23.16,24.69 20.65,24.69 19.81,23.85 19.81,23.83 v19.92,23.88
SCL  (via drill 0.38)
  Top 0.305: SD.8 26.92,20.93 28.27,19.58 29.95,19.58 30.48,20.12 30.48,21.87 29.41,22.94 29.41,24.46 27.36,26.52 22.1,26.52 21.03,27.58 v21.03,30.94
  Bottom 0.152: CLK.3 18.52,29.18 18.29,29.41 18.29,30.02 18.75,30.48 19.66,30.48 19.89,30.79 19.89,31.28 R6.1 | IC1.16 15.6,38.35 13.87,40.08 7.16,40.08 6.55,39.47 6.55,37.8 7.16,37.19 7.16,34.14 7.47,33.83 8.53,33.83 8.69,33.98 8.69,35.36 IC3.4
  Bottom 0.203: R6.1 19.83,31.87 20.19,32.23 20.19,33.38 19.81,33.76 18.44,33.76 16.31,35.89 15.74,35.89 IC1.16
  Bottom 0.305: v21.03,30.94 20.57,31.39 19.88,31.39 R6.1
SDA  (via drill 0.38)
  Top 0.305: v4.88,34.59 5.94,34.59 10.36,39.01 v12.95,39.01
  Top 0.406: SD.9 6.71,20.93 6.71,22.4 5.94,23.16 5.94,24.94 arc-45 5.98,25.03 6.86,25.91 10.62,25.91 arc45 10.71,25.95 11.2,26.44 11.2,32.61 11.66,33.07 v14.02,33.07
  Bottom 0.152: CLK.2 18.26,28.53 17.75,29.03 17.75,32.34 R7.1 17.75,32.68 17.75,33.76 16.61,34.9 15.39,34.9 | 15.39,34.9 14.94,35.36 14.94,36.02 IC1.15 14.94,36.04 14.94,36.73 15.09,36.88 15.09,38.33 14.4,39.01 v12.95,39.01 | IC3.5 5.83,34.92 5.71,34.79 5.07,34.79 v4.88,34.59 | v14.02,33.07 14.94,33.98 14.94,34.44 15.39,34.9
SER  (via drill 0.38)
  Top 0.305: SD.7 24.15,20.2 24.77,19.58 26.82,19.58 v27.51,18.82
  Bottom 0.152: v27.51,18.82 26.98,19.43 26.98,21.95 26.67,22.25 24.4,22.25 SR.14
T2
  Bottom 0.152: MUX16B.2 8.51,16.89 6.86,15.24 6.86,7.16 8.38,5.64 11.43,5.64 11.73,5.33 11.73,4.71 OMNETICS.T2
T3
  Bottom 0.152: MUX16B.3 8.32,16.25 7.16,15.09 7.16,7.32 8.53,5.94 11.73,5.94 12.34,5.33 12.34,4.74 OMNETICS.T3
T4
  Bottom 0.152: MUX16B.4 8.13,15.6 7.47,14.94 7.47,7.47 8.69,6.25 12.19,6.25 13.03,5.41 13.03,4.69 OMNETICS.T4
T5
  Bottom 0.152: MUX16B.5 8.24,14.95 7.77,14.48 7.77,7.62 8.84,6.55 12.5,6.55 13.64,5.41 13.64,4.79 OMNETICS.T5
T6
  Bottom 0.152: MUX16B.6 8.35,14.29 8.08,14.02 8.08,7.77 8.99,6.86 12.95,6.86 14.33,5.49 14.33,4.74 OMNETICS.T6
T7
  Bottom 0.152: MUX16B.7 8.62,13.64 8.38,13.41 8.38,7.92 9.14,7.16 13.41,7.16 14.94,5.64 14.94,4.71 OMNETICS.T7
T8
  Bottom 0.152: MUX16B.8 9.03,12.99 8.69,12.65 8.69,8.08 9.3,7.47 13.72,7.47 15.54,5.64 15.54,4.71 OMNETICS.T8
T9
  Bottom 0.152: MUX16B.9 9.14,12.35 8.99,12.19 8.99,8.23 9.45,7.77 14.17,7.77 16.15,5.79 16.15,4.74 OMNETICS.T9
T10
  Bottom 0.152: OMNETICS.T10 16.83,6.31 17.07,6.55 17.07,12.19 16.92,12.34 MUX16A.16
T11
  Bottom 0.152: OMNETICS.T11 17.46,6.46 17.37,6.55 17.37,12.65 17.07,12.95 16.07,12.95 MUX16A.17
T12
  Bottom 0.152: OMNETICS.T12 18.1,6.29 17.68,6.71 17.68,13.11 17.07,13.72 16.1,13.72 MUX16A.18
T13
  Bottom 0.152: OMNETICS.T13 18.73,6.11 17.98,6.86 17.98,13.72 17.37,14.33 16.06,14.33 MUX16A.19
T14
  Bottom 0.152: OMNETICS.T14 19.37,5.93 18.29,7.01 18.29,14.17 17.53,14.94 16.04,14.94 MUX16A.20
T15
  Bottom 0.152: OMNETICS.T15 20,5.45 19.96,5.49 19.96,5.79 18.59,7.16 18.59,14.48 17.53,15.54 16.08,15.54 MUX16A.21
T16
  Bottom 0.152: OMNETICS.T16 20.64,5.58 18.9,7.32 18.9,14.94 17.68,16.15 16.12,16.15 MUX16A.22
T17
  Bottom 0.152: OMNETICS.T17 21.27,5.4 19.2,7.47 19.2,15.39 17.68,16.92 16.05,16.92 MUX16A.23
TEST_IN
  Bottom 0.152: 13.03,28.05 IC1.5 | 14.44,26.67 R8.2
  Bottom 0.254: R8.2 14.46,26.52 12.72,26.52 13.03,26.82 13.03,28.05
  Bottom 0.305: MUX3X2.5 11.95,23.23 12.72,24 12.72,26.52
TEST_OUT  (via drill 0.38)
  Top 0.305: v13.56,25.6 12.04,25.6 v11.89,25.83
  Bottom 0.152: MUX3X2.2 11.42,21.32 13.56,23.47 v13.56,25.6 | v11.89,25.83 11.89,27.05 12.34,27.51 IC1.6
VBAT
  Top 0.254: 9.28,12.95 CHARGE.3
  Top 0.406: JP1.2 8.28,16.1 8.53,15.85 8.53,13.26 8.84,12.95 | 8.84,12.95 9.28,12.95 | Q1.3 1.07,8.08 0.76,8.38 0.76,10.52 1.14,10.9 7.85,10.9 8.69,11.73 8.69,12.8 8.84,12.95
VIN  (via drill 0.38)
  Top 0.254: CONV.3 CONV.2 16.41,11.32 15.7,12.04 15.7,14.02 15.24,14.48 13.51,14.48 C1.1
  Top 0.305: C1.1 13.51,16.51 13.26,16.76 v12.8,16.76 | Q1.2 1.83,7.11 1.83,6.33 1.69,6.17 1.56,6.04 v1.56,5.6
  Route3 0.61: v1.56,5.6 1.56,8.35 7.7,14.48 11.89,14.48 12.8,15.24 v12.8,16.76
VUSB  (via drill 0.38)
  Top 0.254: 14.86,12.04 14.86,13.18 14.17,13.87 12.34,13.87 12.04,14.17 12.04,14.78 11.56,15.27 C3.1 10.41,15.65 10.41,16.87 10.06,17.22 9.22,17.22 8.31,18.14 6.25,18.14 5.33,19.05 5.33,20.27 v4.72,20.88
  Top 0.406: CHARGE.4 9.45,10.52 9.45,11.43 9.68,11.66 12.12,11.66 12.5,12.04 14.86,12.04 14.94,12.04 15.7,11.28 15.7,9.6 16,9.3 21.49,9.3 21.95,9.75 21.95,11.12 22.86,12.04 24.98,12.04 | 25.76,12.04 24.98,12.04 | 24.98,12.04 USB.VBUS
  Bottom 0.406: R4.1 v4.72,20.88
W  (via drill 0.38)
  Top 0.305: v9.6,29.49 v9.6,31.24
  Bottom 0.152: v9.6,29.49 7.54,29.49 6.63,28.57 IC2.1 | v9.6,31.24 9.6,37.19 9.45,37.34 8.65,37.34 IC3.1

### Text on the board
bPlace: v11
bNames: autoimpedance 2.0
203bmp: //kentro/work/Eagle/Projects/SandBox/Jim/Electric Imp/built-for-imp16.bmp